# Altium schematic sheet LM386AMPLIFIER.SchDoc
size 420 x 297 mm; SheetNumber: 1; SheetTotal: 1
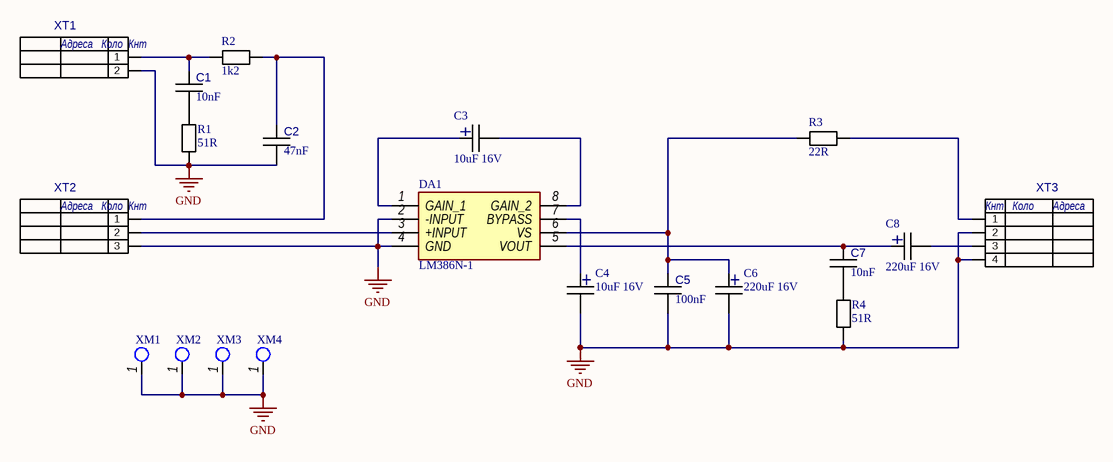
[diagram p0: LM386AMPLIFIER.SchDoc]

## Parts
C1  10nF  [C1206M]
C2  47nF  [C1206M]
C3  10uF 16V  [D6.3_P2.5]
C4  10uF 16V  [D6.3_P2.5]
C5  100nF  [C1206M]
C6  220uF 16V  [D6.3_P2.5]
C7  10nF  [C1206M]
C8  220uF 16V  [D6.3_P2.5]
DA1  LM386N-1  [DIP8]
R1  51R  [R1206M]
R2  1k2  [R1206M]
R3  22R  [R1206M]
R4  51R  [R1206M]
XM1  (no value)  [XM_D6.5mm_d3.6mm]
XM2  (no value)  [XM_D6.5mm_d3.6mm]
XM3  (no value)  [XM_D6.5mm_d3.6mm]
XM4  (no value)  [XM_D6.5mm_d3.6mm]
XT1  X2  [WF2]  (value not drawn)
XT2  X3  [WF3]  (value not drawn)
XT3  X4  [WF4]  (value not drawn)

## Nets
GND: C2.2 C4.2 C5.2 C6.2 DA1.2(-INPUT) DA1.4(GND) R1.1 R4.1 XM1.1 XM2.1 XM3.1 XM4.1 XT1.2 XT2.3 XT3.2 XT3.4
NetC1_1: C1.1 R2.2 XT1.1
NetC1_2: C1.2 R1.2
NetC2_1: C2.1 R2.1 XT2.1
NetC3_1: C3.1 DA1.1(GAIN_1)
NetC3_2: C3.2 DA1.8(GAIN_2)
NetC4_1: C4.1 DA1.7(BYPASS)
NetC5_1: C5.1 C6.1 DA1.6(VS) R3.1
NetC7_1: C7.1 C8.1 DA1.5(VOUT)
NetC7_2: C7.2 R4.2
NetC8_2: C8.2 XT3.3
NetDA1_3: DA1.3(+INPUT) XT2.2
NetR3_2: R3.2 XT3.1

## Notes on the sheet
- Перв. викор
- Довідк. №
- Підпис і дата
- Інв. № дубл.
- Взам. інв. №
- Розроб.
- Зм.
- Арк.
- № докум.
- Підп.
- Дата
- Літ.
- Маса
- Масштаб
- Інв. № ориг.
- Перев.
- Т.контр.
- Аркушів
- Затв.
- Н.контр.
- Копіював
- Формат А3
- (in symbol CAP_EL) +
- (in symbol X2) Адреса; Коло; Кнт
- (in symbol X3) Адреса; Коло; Кнт
- (in symbol X4) Кнт; Коло; Адреса

## Library data of the parts
C1 C2 C5 C7 = CAP
C3 C4 C6 C8 = CAP_EL
DA1 = LM386N-1: TEXAS INSTRUMENTS - LM386N-1 - AUDIO POWER AMPLIFIER, CLASS AB, 325mW DIP-8; Geometry.Height: 5.08mm; Mouser Part Number: 926-LM386N-1; Mouser Price/Stock: https://www.mouser.co.uk/ProductDetail/Texas-Instruments/LM386N-1?qs=QbsRYf82W3Gpu7TCrwcmkA%3D%3D; Manufacturer_Name: Texas Instruments; Manufacturer_Part_Number: LM386N-1; Datasheet Link: https://www.ti.com/lit/ds/symlink/lm386.pdf?ts=1618981830930&ref_url=https%253A%252F%252Fwww.ti.com%252Fstore%252Fti%252Fen%252Fp%252Fproduct%252F%253Fp%253DLM386N-1%252FNOPB%2526keyMatch%253DLM386N-1%2526tisearch%253Dsearch-everything
R1-R4 = RES
XM1-XM4 = XM